# EAGLE schematic untitled (EAGLE 6.4)
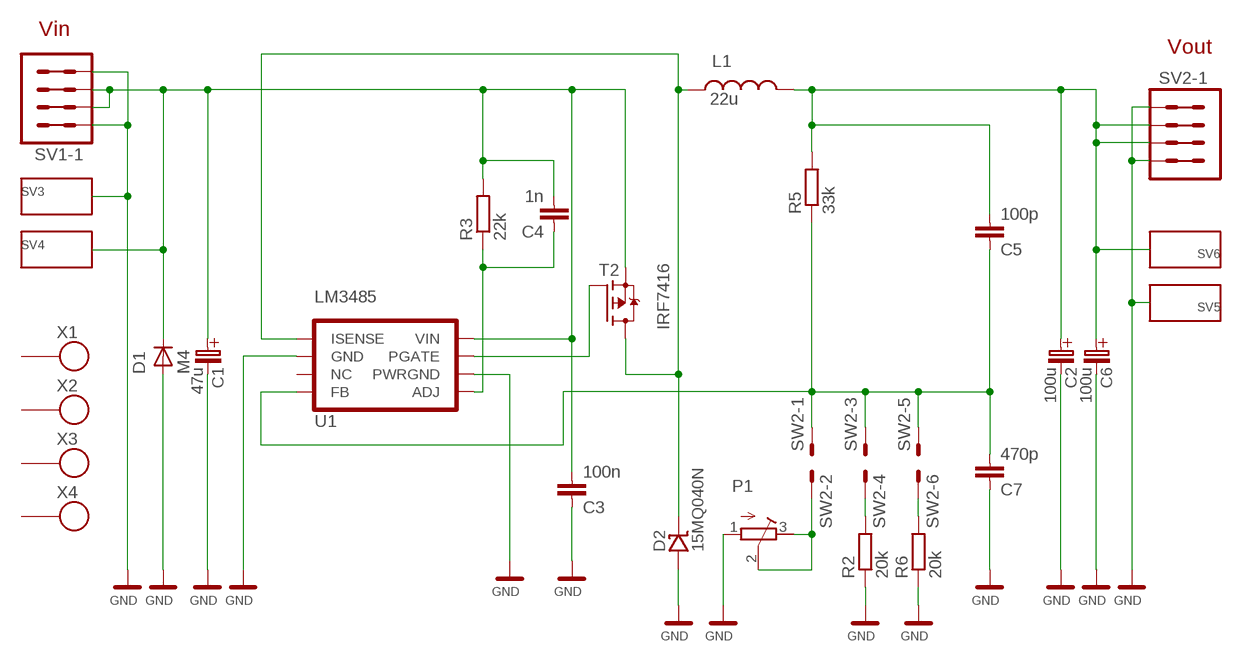
[diagram p0: schematic, sheet 1]

## Parts
C1  47u  C  [C]
C2  100u  C  [C]
C3  100n  C0805  [C0805]
C4  1n  C0805  [C0805]
C5  100p  C0805  [C0805]
C6  100u  C  [C]
C7  470p  C0805  [C0805]
D1  M4  D-OB.SMA  [SMA]
D2  15MQ040N  D-SHOTKY-SMA  [SMA]
L1  22u  DE1205-10  [DE1205-10]
P1  TRIM_CA9MTV10  [TRIM_CA9MTV10]
R2  20k  R0805  [0805]
R3  22k  R0805  [0805]
R5  33k  R0805  [0805]
R6  20k  R0805  [0805]
SV1  MA04-2  [MA04-2]
SV2  MA04-2  [MA04-2]
SV3  WAGO256  [WAGO256]
SV4  WAGO256  [WAGO256]
SV5  WAGO256  [WAGO256]
SV6  WAGO256  [WAGO256]
SW2  MA03-3  [MA03-2]
T2  IRF7416  [SO8]
U1  LM3485  [MSOP-8]
X1  SROUB3M  [SROUB3M]
X2  SROUB3M  [SROUB3M]
X3  SROUB3M  [SROUB3M]
X4  SROUB3M  [SROUB3M]

## Nets
GND: C1.-(C_EL-) C2.-(C_EL-) C3.1 C6.-(C_EL-) C7.1 D1.A D2.A P1.1 R2.1 R6.1 SV1.1 SV1.2 SV1.7 SV1.8 SV2.1 SV2.2 SV2.7 SV2.8 SV3.1 SV3.A1 SV5.1 SV5.A1 U1.2(GND) U1.6(PWRGND)
N$1: T2.4(G) U1.7(PGATE)
N$2: C1.+(C_EL+) C3.2 C4.2 D1.K(C) R3.2 SV1.3 SV1.4 SV1.5 SV1.6 SV4.1 SV4.A1 T2.1(S) T2.2(S) T2.3(S) U1.8(VIN)
N$3: C5.1 C7.2 R5.1 SW2.1 SW2.3 SW2.5 U1.4(FB)
N$4: C4.1 R3.1 U1.5(ADJ)
N$5: C2.+(C_EL+) C5.2 C6.+(C_EL+) L1.P$2 R5.2 SV2.3 SV2.4 SV2.5 SV2.6 SV6.1 SV6.A1
N$6: D2.K L1.P$1 T2.5(D) T2.6(D) T2.7(D) T2.8(D) U1.1(ISENSE)
N$10: R2.2 SW2.4
N$11: R6.2 SW2.6
N$12: P1.2 P1.3 SW2.2
Unconnected: U1.3(NC) X1.P$1 X2.P$1 X3.P$1 X4.P$1

## Notes on the sheet
- Vin
- Vout

## Library data of the parts
C1 C2 C6 = moje_C:C
C3-C5 C7 = moje_C:C0805
D1 = moje:D-OB.SMA: SMA
D2 = moje_diody:D-SHOTKY-SMA
L1 = moje_L:DE1205-10: tlumivka
P1 = moje_pot:TRIM_CA9MTV10
R2 R3 R5 R6 = moje_R:R0805
SV1 SV2 = moje_hrebinky:MA04-2: PIN HEADER; OC_FARNELL: unknown; OC_NEWARK: unknown
SV3-SV6 = moje_konektory:WAGO256: WAGO256
SW2 = moje_hrebinky:MA03-3
T2 = moje_T:IRF7416
U1 = ciza_io:LM3485
X1-X4 = moje:SROUB3M